# Altium schematic sheet MAIN.SchDoc
size A3
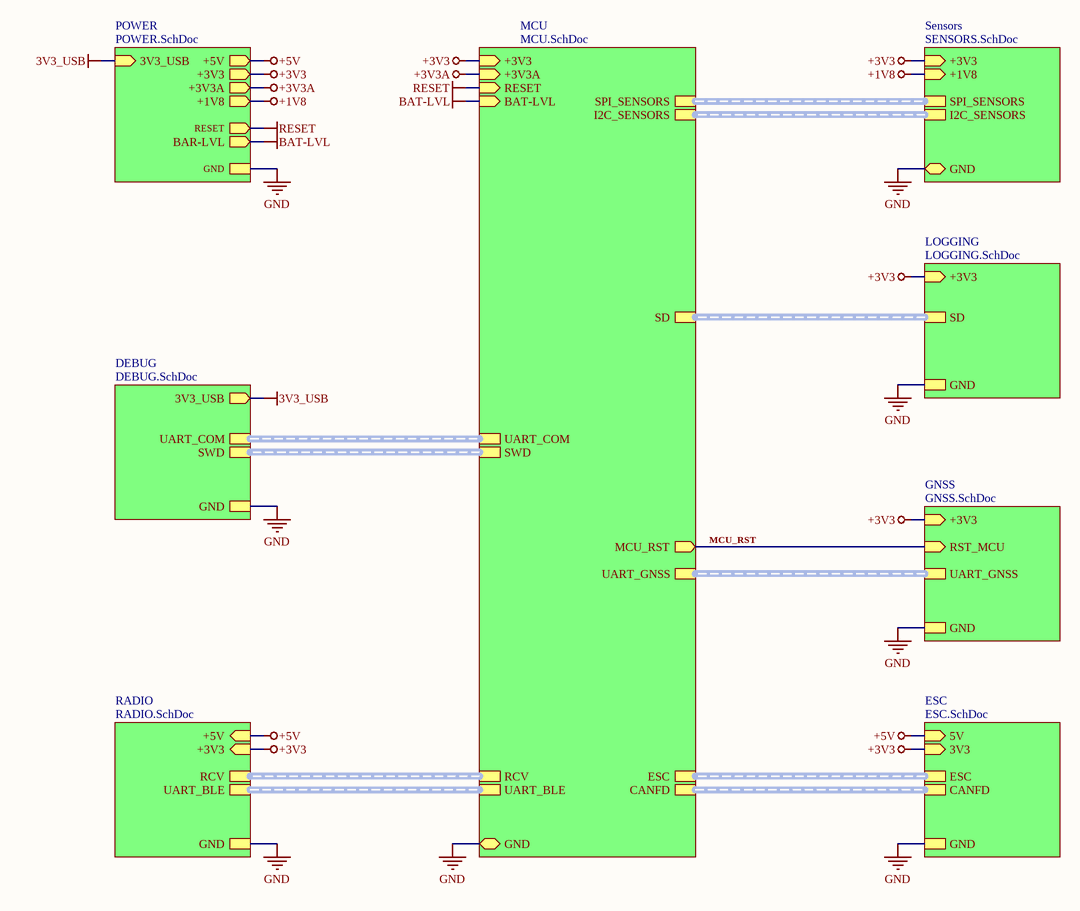
[diagram p0: MAIN.SchDoc]

## Sub-sheets
DEBUG = DEBUG.SchDoc: GND, 3V3_USB (out), UART_COM (harness UART_COM), SWD (harness SWD)
ESC = ESC.SchDoc: 5V (in), 3V3 (in), GND, ESC (harness ESC), CANFD (harness CANFD)
GNSS = GNSS.SchDoc: +3V3 (in), GND, RST_MCU (in), UART_GNSS (harness UART_GNSS)
LOGGING = LOGGING.SchDoc: +3V3 (in), GND, SD (harness SD)
MCU = MCU.SchDoc: +3V3 (in), GND (bidir), +3V3A (in), RESET (in), SWD (harness SWD), UART_GNSS (harness UART_GNSS), UART_COM (harness UART_COM), RCV (harness RCV), ESC (harness ESC), CANFD (harness CANFD), SD (harness SD), SPI_SENSORS (harness SPI_SENSORS), I2C_SENSORS (harness I2C_SENSORS), BAT-LVL (in), MCU_RST (out), UART_BLE (harness UART_BLE)
POWER = POWER.SchDoc: +5V (out), +3V3 (out), +1V8 (out), GND, RESET (out), +3V3A (out), 3V3_USB (in), BAR-LVL (out)
RADIO = RADIO.SchDoc: +5V (in), +3V3 (in), GND, RCV (harness RCV), UART_BLE (harness UART_BLE)
Sensors = SENSORS.SchDoc: +3V3 (in), GND (bidir), +1V8 (in), SPI_SENSORS (harness SPI_SENSORS), I2C_SENSORS (harness I2C_SENSORS)

## Nets
3V3_USB: sheet POWER/3V3_USB, sheet DEBUG/3V3_USB
+1V8: sheet Sensors/+1V8, sheet POWER/+1V8
+3V3: sheet MCU/+3V3, sheet Sensors/+3V3, sheet LOGGING/+3V3, sheet GNSS/+3V3, sheet POWER/+3V3, sheet ESC/3V3, sheet RADIO/+3V3
+3V3A: sheet MCU/+3V3A, sheet POWER/+3V3A
+5V: sheet POWER/+5V, sheet ESC/5V, sheet RADIO/+5V
BAT-LVL: sheet MCU/BAT-LVL, sheet POWER/BAR-LVL
GND: sheet MCU/GND, sheet Sensors/GND, sheet LOGGING/GND, sheet GNSS/GND, sheet POWER/GND, sheet DEBUG/GND, sheet ESC/GND, sheet RADIO/GND
RESET: sheet MCU/RESET, sheet POWER/RESET
MCU_RST: sheet MCU/MCU_RST, sheet GNSS/RST_MCU

## Buses and harness runs
harness sheet DEBUG/SWD = sheet MCU/SWD
harness sheet DEBUG/UART_COM = sheet MCU/UART_COM
harness sheet ESC/CANFD = sheet MCU/CANFD
harness sheet ESC/ESC = sheet MCU/ESC
harness sheet GNSS/UART_GNSS = sheet MCU/UART_GNSS
harness sheet LOGGING/SD = sheet MCU/SD
harness sheet MCU/I2C_SENSORS = sheet Sensors/I2C_SENSORS
harness sheet MCU/RCV = sheet RADIO/RCV
harness sheet MCU/SPI_SENSORS = sheet Sensors/SPI_SENSORS
harness sheet MCU/UART_BLE = sheet RADIO/UART_BLE